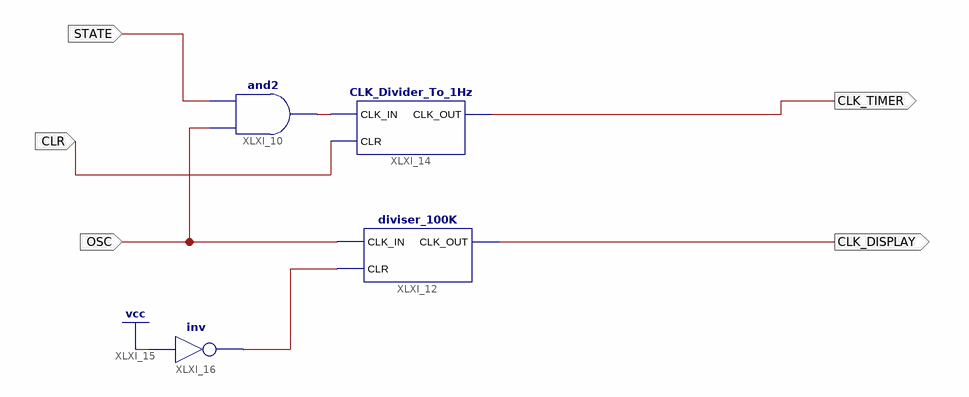
[diagram p0: schematic sheet 1]
// Xilinx ISE schematic CLK_Divider_20MHz.sch (spartan6) as structural Verilog: 4 symbols, 5 ports
module CLK_Divider_20MHz (
  input  OSC,
  input  STATE,
  input  CLR,
  output CLK_DISPLAY,
  output CLK_TIMER
);

  wire XLXN_1, XLXN_3;

  and XLXI_10 (XLXN_1, OSC, STATE);
  diviser_100K XLXI_12 (.CLK_IN(OSC), .CLK_OUT(CLK_DISPLAY), .CLR(XLXN_3));
  CLK_Divider_To_1Hz XLXI_14 (.CLK_IN(XLXN_1), .CLK_OUT(CLK_TIMER), .CLR(CLR));
  not XLXI_16 (XLXN_3, 1'b1);
endmodule
